# EAGLE design tqfp-80 (EAGLE 6.4)
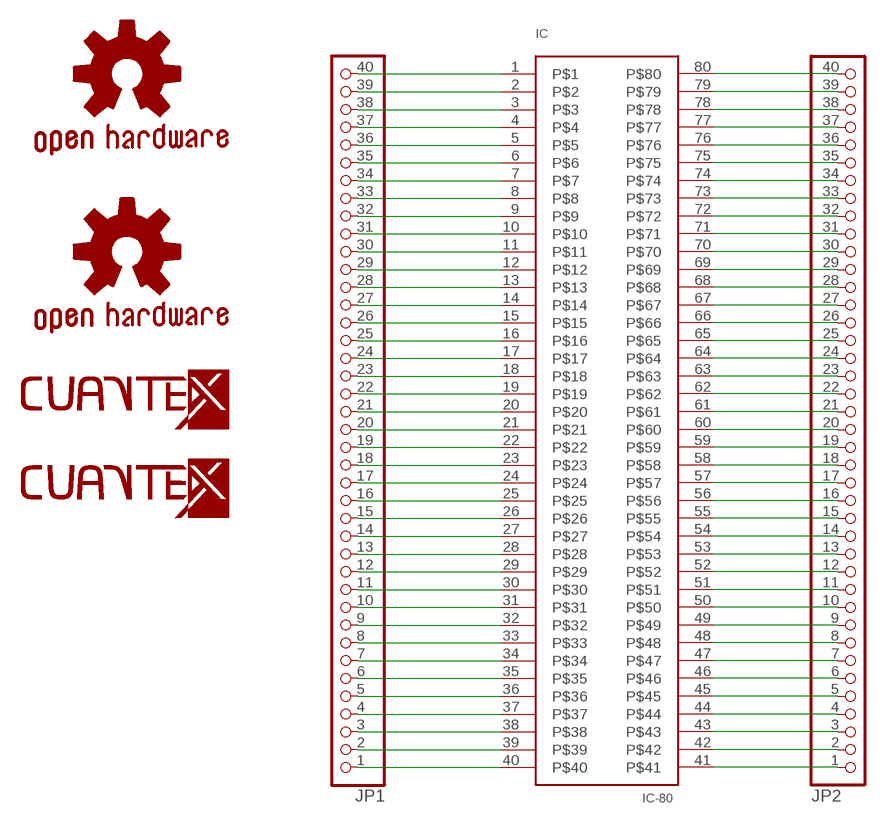
[diagram p0: schematic, sheet 1]

## Parts
GOLD_ORB_SM1  OSHWLOGO_GOLD_ORB_SM  [OSHW2]
GOLD_ORB_SM2  OSHWLOGO_GOLD_ORB_SM  [OSHW2]
IC  IC-80  [TQFP-80]
JP1  PINHD-1X40  [1X40]
JP2  PINHD-1X40  [1X40]
U$2  LOGO-TOP-30MM  [C-1]
U$3  LOGO-TOP-15MM  [C-00]

## Nets
N$1: IC.40 JP1.1
N$2: IC.39 JP1.2
N$3: IC.38 JP1.3
N$4: IC.37 JP1.4
N$5: IC.36 JP1.5
N$6: IC.35 JP1.6
N$7: IC.34 JP1.7
N$8: IC.33 JP1.8
N$9: IC.32 JP1.9
N$10: IC.31 JP1.10
N$11: IC.30 JP1.11
N$12: IC.29 JP1.12
N$13: IC.28 JP1.13
N$14: IC.27 JP1.14
N$15: IC.26 JP1.15
N$16: IC.25 JP1.16
N$17: IC.24 JP1.17
N$18: IC.23 JP1.18
N$19: IC.22 JP1.19
N$20: IC.21 JP1.20
N$21: IC.20 JP1.21
N$22: IC.19 JP1.22
N$23: IC.18 JP1.23
N$24: IC.17 JP1.24
N$25: IC.16 JP1.25
N$26: IC.15 JP1.26
N$27: IC.14 JP1.27
N$28: IC.13 JP1.28
N$29: IC.12 JP1.29
N$30: IC.11 JP1.30
N$31: IC.10 JP1.31
N$32: IC.9 JP1.32
N$33: IC.8 JP1.33
N$34: IC.7 JP1.34
N$35: IC.6 JP1.35
N$36: IC.5 JP1.36
N$37: IC.4 JP1.37
N$38: IC.3 JP1.38
N$39: IC.2 JP1.39
N$40: IC.1 JP1.40
N$41: IC.41 JP2.1
N$42: IC.42 JP2.2
N$43: IC.43 JP2.3
N$44: IC.44 JP2.4
N$45: IC.45 JP2.5
N$46: IC.46 JP2.6
N$47: IC.47 JP2.7
N$48: IC.48 JP2.8
N$49: IC.49 JP2.9
N$50: IC.50 JP2.10
N$51: IC.51 JP2.11
N$52: IC.52 JP2.12
N$53: IC.53 JP2.13
N$54: IC.54 JP2.14
N$55: IC.55 JP2.15
N$56: IC.56 JP2.16
N$57: IC.57 JP2.17
N$58: IC.58 JP2.18
N$59: IC.59 JP2.19
N$60: IC.60 JP2.20
N$61: IC.61 JP2.21
N$62: IC.62 JP2.22
N$63: IC.63 JP2.23
N$64: IC.64 JP2.24
N$65: IC.65 JP2.25
N$66: IC.66 JP2.26
N$67: IC.67 JP2.27
N$68: IC.68 JP2.28
N$69: IC.69 JP2.29
N$70: IC.70 JP2.30
N$71: IC.71 JP2.31
N$72: IC.72 JP2.32
N$73: IC.73 JP2.33
N$74: IC.74 JP2.34
N$75: IC.75 JP2.35
N$76: IC.76 JP2.36
N$77: IC.77 JP2.37
N$78: IC.78 JP2.38
N$79: IC.79 JP2.39
N$80: IC.80 JP2.40

## Library data of the parts
GOLD_ORB_SM1 GOLD_ORB_SM2 = OPENHW:OSHWLOGO: These are Open-Source Hardware logos.
IC = cu01:IC-80
JP1 JP2 = pinhead:PINHD-1X40: PIN HEADER
U$2 = LOGOTIPOS:LOGO-TOP-30MM
U$3 = LOGOTIPOS:LOGO-TOP-15MM

## Board
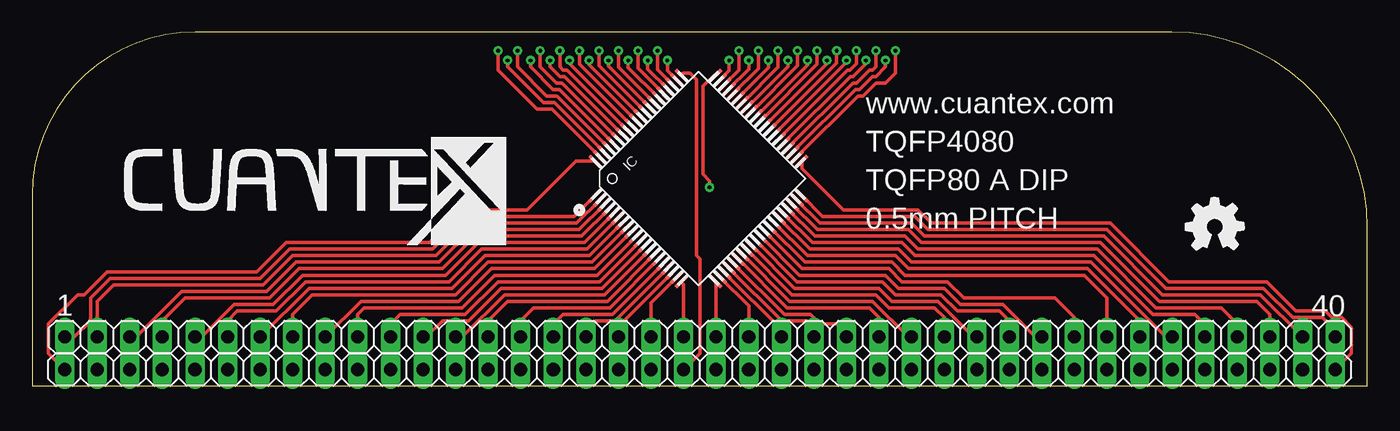
[diagram p1: board, top side]
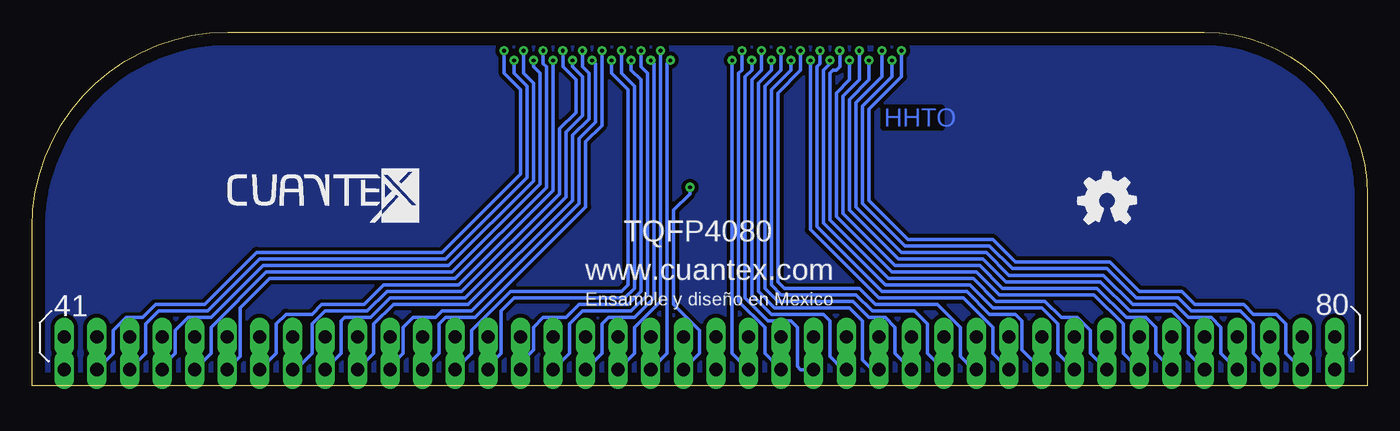
[diagram p2: board, bottom side, seen from below]

Size 104.12 x 27.61 mm. Coordinates in mm from the lower left corner, seen from the top.
Outline: 0,0 104.12,0 104.12,12.36 arc90 88.87,27.61 12.73,27.61 arc90 0,14.88 0,0
Copper layers (1*16): Top 0.035mm / dielectric 1.5mm / Bottom 0.035mm
Design rules "default *": minimum track width 10mil, minimum drill 24mil, track to track 8mil, track to pad 8mil, pad to pad 8mil, via to via 8mil, smd to smd 8mil, copper to edge 40mil, drill to drill 8mil, minimum pad ring 10mil, minimum via ring 8mil, stop-mask expansion 4mil, vias tented up to drill 0mil, thermal gap 10mil

### Footprints (pad centres in the part's own frame; a part is rotated, then mirrored left to right if it is on the bottom)
TQFP-80 = smd 1.2 x 0.27: 1 -5.89,4.6; 2 -5.89,4.1; 3 -5.89,3.6; 4 -5.89,3.1; 5 -5.89,2.6; 6 -5.89,2.1; 7 -5.89,1.6; 8 -5.89,1.1; 9 -5.89,0.6; 10 -5.89,0.1; 11 -5.89,-0.4; 12 -5.89,-0.9; 13 -5.89,-1.4; 14 -5.89,-1.9; 15 -5.89,-2.4; 16 -5.89,-2.9; 17 -5.89,-3.4; 18 -5.89,-3.9; 19 -5.89,-4.4; 20 -5.89,-4.9; 41 7.41,-4.9; 42 7.41,-4.4; 43 7.41,-3.9; 44 7.41,-3.4; 45 7.41,-2.9; 46 7.41,-2.4; 47 7.41,-1.9; 48 7.41,-1.4; 49 7.41,-0.9; 50 7.41,-0.4; 51 7.41,0.1; 52 7.41,0.6; 53 7.41,1.1; 54 7.41,1.6; 55 7.41,2.1; 56 7.41,2.6; 57 7.41,3.1; 58 7.41,3.6; 59 7.41,4.1; 60 7.41,4.6 | smd 0.27 x 1.2: 21 -3.99,-6.8; 22 -3.49,-6.8; 23 -2.99,-6.8; 24 -2.49,-6.8; 25 -1.99,-6.8; 26 -1.49,-6.8; 27 -0.99,-6.8; 28 -0.49,-6.8; 29 0.01,-6.8; 30 0.51,-6.8; 31 1.01,-6.8; 32 1.51,-6.8; 33 2.01,-6.8; 34 2.51,-6.8; 35 3.01,-6.8; 36 3.51,-6.8; 37 4.01,-6.8; 38 4.51,-6.8; 39 5.01,-6.8; 40 5.51,-6.8; 61 5.51,6.5; 62 5.01,6.5; 63 4.51,6.5; 64 4.01,6.5; 65 3.51,6.5; 66 3.01,6.5; 67 2.51,6.5; 68 2.01,6.5; 69 1.51,6.5; 70 1.01,6.5; 71 0.51,6.5; 72 0.01,6.5; 73 -0.49,6.5; 74 -0.99,6.5; 75 -1.49,6.5; 76 -1.99,6.5; 77 -2.49,6.5; 78 -2.99,6.5; 79 -3.49,6.5; 80 -3.99,6.5
1X40 = drill 1.016 long: 1 -49.53,0; 2 -46.99,0; 3 -44.45,0; 4 -41.91,0; 5 -39.37,0; 6 -36.83,0; 7 -34.29,0; 8 -31.75,0; 9 -29.21,0; 10 -26.67,0; 11 -24.13,0; 12 -21.59,0; 13 -19.05,0; 14 -16.51,0; 15 -13.97,0; 16 -11.43,0; 17 -8.89,0; 18 -6.35,0; 19 -3.81,0; 20 -1.27,0; 21 1.27,0; 22 3.81,0; 23 6.35,0; 24 8.89,0; 25 11.43,0; 26 13.97,0; 27 16.51,0; 28 19.05,0; 29 21.59,0; 30 24.13,0; 31 26.67,0; 32 29.21,0; 33 31.75,0; 34 34.29,0; 35 36.83,0; 36 39.37,0; 37 41.91,0; 38 44.45,0; 39 46.99,0; 40 49.53,0

### Placement (x,y rotation side)
GOLD_ORB_SM1  88.39,8.13 0 top
GOLD_ORB_SM2  24.13,10.16 0 bottom
IC  51.31,15.75 45 top
JP1  52.07,3.81 180 top
JP2  52.07,1.27 180 top
U$2  7.11,10.92 0 top
U$3  88.9,12.7 0 bottom

### Tracks (layer width: path | path; a pad name or v marks a point on that pad's centre or on a via)
N$1
  Top 0.254: IC.40 61.64,13.21 68.83,13.21 69.85,12.19 83.82,12.19 88.39,7.62 96.01,7.62 98.3,5.33 100.58,5.33 101.6,4.32 JP1.1
N$2
  Top 0.254: IC.39 61.44,12.7 68.58,12.7 69.6,11.68 83.57,11.68 88.14,7.11 95.76,7.11 JP1.2
N$3
  Top 0.254: IC.38 61.24,12.19 68.33,12.19 69.34,11.18 83.31,11.18 87.88,6.6 95.5,6.6 96.52,5.59 JP1.3
N$4
  Top 0.254: IC.37 61.04,11.68 68.07,11.68 69.09,10.67 83.06,10.67 87.63,6.1 92.71,6.1 93.98,4.83 JP1.4
N$5
  Top 0.254: IC.36 60.84,11.18 67.82,11.18 68.83,10.16 82.8,10.16 87.38,5.59 90.68,5.59 91.44,4.83 JP1.5
N$6
  Top 0.254: IC.35 60.65,10.67 67.56,10.67 68.58,9.65 82.55,9.65 88.39,3.81 JP1.6
N$7
  Top 0.254: IC.34 60.45,10.16 67.31,10.16 68.33,9.14 82.3,9.14 86.36,5.08 JP1.7
N$8
  Top 0.254: IC.33 60.25,9.65 67.06,9.65 68.07,8.64 82.04,8.64 83.82,6.86 JP1.8
N$9
  Top 0.254: IC.32 60.05,9.14 66.8,9.14 67.82,8.13 71.37,8.13 72.64,6.86 79.76,6.86 81.28,5.33 JP1.9
N$10
  Top 0.254: IC.31 59.85,8.64 66.55,8.64 67.56,7.62 71.12,7.62 72.39,6.35 75.69,6.35 78.23,3.81 JP1.10
N$11
  Top 0.254: IC.30 59.65,8.13 66.29,8.13 67.31,7.11 70.87,7.11 72.14,5.84 75.44,5.84 76.2,5.08 JP1.11
N$12
  Top 0.254: IC.29 59.45,7.62 66.04,7.62 67.06,6.6 70.61,6.6 73.41,3.81 JP1.12
N$13
  Top 0.254: IC.28 59.25,7.11 65.79,7.11 66.8,6.1 70.36,6.1 71.12,5.33 JP1.13
N$14
  Top 0.254: IC.27 59.05,6.6 65.53,6.6 68.33,3.81 JP1.14
N$15
  Top 0.254: IC.26 58.85,6.1 65.28,6.1 66.04,5.33 JP1.15
N$16
  Top 0.254: IC.25 58.65,5.59 60.71,5.59 61.47,4.83 62.99,4.83 63.5,4.32 JP1.16
N$17
  Top 0.254: IC.24 58.45,5.08 60.45,5.08 60.96,4.57 JP1.17
N$18
  Top 0.254: IC.23 58.42,4.41 JP1.18
N$19
  Top 0.254: IC.22 55.88,6.24 JP1.19
N$20
  Top 0.254: IC.21 53.34,8.07 JP1.20
N$21
  Top 0.254: IC.20 50.8,7.93 JP1.21
N$22
  Top 0.254: IC.19 48.26,6.48 JP1.22
N$23
  Top 0.254: IC.18 45.72,4.64 JP1.23
N$24
  Top 0.254: IC.17 45.45,5.08 43.94,5.08 43.18,4.32 JP1.24
N$25
  Top 0.254: IC.16 45.25,5.59 41.4,5.59 40.64,4.83 JP1.25
N$26
  Top 0.254: IC.15 45.05,6.1 39.12,6.1 38.1,5.08 JP1.26
N$27
  Top 0.254: IC.14 44.85,6.6 37.08,6.6 35.56,5.08 JP1.27
N$28
  Top 0.254: IC.13 44.65,7.11 36.83,7.11 33.53,3.81 JP1.28
N$29
  Top 0.254: IC.12 44.45,7.62 36.58,7.62 34.04,5.08 32,5.08 30.73,3.81 JP1.29
N$30
  Top 0.254: IC.11 44.25,8.13 36.32,8.13 33.78,5.59 28.7,5.59 27.94,4.83 JP1.30
N$31
  Top 0.254: IC.10 44.05,8.64 36.07,8.64 33.53,6.1 25.91,6.1 25.4,5.59 JP1.31
N$32
  Top 0.254: IC.9 43.85,9.14 35.81,9.14 33.27,6.6 25.65,6.6 JP1.32
N$33
  Top 0.254: IC.8 43.66,9.65 35.56,9.65 33.02,7.11 21.84,7.11 20.32,5.59 JP1.33
N$34
  Top 0.254: IC.7 43.46,10.16 35.31,10.16 32.77,7.62 21.59,7.62 JP1.34
N$35
  Top 0.254: IC.6 43.26,10.67 35.05,10.67 32.51,8.13 21.34,8.13 19.05,5.84 16,5.84 15.24,5.08 JP1.35
N$36
  Top 0.254: IC.5 43.06,11.18 34.8,11.18 32.26,8.64 21.08,8.64 18.8,6.35 15.75,6.35 13.21,3.81 JP1.36
N$37
  Top 0.254: IC.4 42.86,11.68 34.54,11.68 32,9.14 20.83,9.14 18.54,6.86 11.94,6.86 10.16,5.08 JP1.37
N$38
  Top 0.254: IC.3 42.66,12.19 34.29,12.19 31.75,9.65 20.57,9.65 18.29,7.37 11.68,7.37 8.13,3.81 JP1.38
N$39
  Top 0.254: IC.2 42.46,12.7 34.04,12.7 31.5,10.16 20.32,10.16 18.03,7.87 6.35,7.87 5.08,6.6 JP1.39
N$40
  Top 0.254: IC.1 42.26,13.21 33.78,13.21 31.24,10.67 20.07,10.67 17.78,8.38 6.1,8.38 4.57,6.86 4.57,5.08 3.3,3.81 JP1.40
N$41
  Top 0.254: JP2.1 102.87,2.54 102.87,4.57 102.11,5.33 101.35,5.33 100.84,5.84 98.55,5.84 96.27,8.13 88.65,8.13 84.07,12.7 70.1,12.7 69.09,13.72 63.25,13.72 60.01,16.95 IC.41
N$42  (via drill 0.3)
  Top 0.254: IC.42 64.39,22.61 64.77,22.61 65.79,23.62 66.55,23.62 67.31,24.38 v67.31,26.16
  Bottom 0.254: JP2.2 97.79,2.54 97.79,4.32 96.77,5.33 95.5,5.33 94.49,6.35 90.68,6.35 86.61,10.41 72.14,10.41 66.04,16.51 66.04,23.11 67.31,24.38 v67.31,26.16
N$43  (via drill 0.3)
  Top 0.254: IC.43 64.19,23.11 64.52,23.11 65.53,24.13 65.79,24.13 66.55,24.89 v66.55,25.4
  Bottom 0.254: JP2.3 95.25,2.54 95.25,4.83 94.23,5.84 90.42,5.84 86.36,9.91 71.88,9.91 65.53,16.26 65.53,23.37 66.55,24.38 v66.55,25.4
N$44  (via drill 0.3)
  Top 0.254: IC.44 63.99,23.62 64.26,23.62 65.28,24.64 65.53,24.64 65.79,24.89 v65.79,26.16
  Bottom 0.254: JP2.4 93.98,1.52 92.96,2.54 92.96,4.32 91.95,5.33 90.17,5.33 86.11,9.4 71.63,9.4 65.02,16 65.02,23.62 65.79,24.38 v65.79,26.16
N$45  (via drill 0.3)
  Top 0.254: IC.45 63.79,24.13 64.01,24.13 65.02,25.15 v65.02,25.4
  Bottom 0.254: JP2.5 90.17,2.54 90.17,4.57 85.85,8.89 71.37,8.89 64.52,15.75 64.52,24.38 65.02,24.89 v65.02,25.4
N$46  (via drill 0.3)
  Top 0.254: IC.46 63.59,24.64 63.75,24.64 64.26,25.15 v64.26,26.16
  Bottom 0.254: JP2.6 87.88,2.29 87.88,6.1 85.6,8.38 71.12,8.38 64.01,15.49 64.01,24.89 64.26,25.15 v64.26,26.16
N$47  (via drill 0.3)
  Top 0.254: IC.47 63.5,25.25 v63.5,25.4
  Bottom 0.254: JP2.7 85.09,2.54 85.09,4.83 84.33,5.59 82.3,5.59 81.53,6.35 78.23,6.35 76.71,7.87 70.87,7.87 63.5,15.24 v63.5,25.4
N$48  (via drill 0.3)
  Top 0.254: IC.48 62.74,25.2 v62.74,26.16
  Bottom 0.254: JP2.8 83.57,1.27 82.3,2.54 82.3,4.83 81.28,5.84 77.98,5.84 76.45,7.37 70.61,7.37 62.99,14.99 62.99,20.07 61.72,21.34 61.72,23.88 62.74,24.89 v62.74,26.16
N$49  (via drill 0.3)
  Top 0.254: IC.49 61.98,25.14 v61.98,25.4
  Bottom 0.254: JP2.9 80.01,2.54 80.01,5.08 79.76,5.33 77.72,5.33 76.2,6.86 70.36,6.86 62.48,14.73 62.48,19.81 61.21,21.08 61.21,24.13 61.98,24.89 v61.98,25.4
N$50  (via drill 0.3)
  Top 0.254: IC.50 61.21,25.09 v61.21,26.16
  Bottom 0.254: JP2.10 77.47,2.54 77.47,4.83 75.95,6.35 70.1,6.35 61.98,14.48 61.98,19.56 60.71,20.83 60.71,24.38 61.21,24.89 v61.21,26.16
N$51  (via drill 0.3)
  Top 0.254: IC.51 60.45,25.03 v60.45,25.4
  Bottom 0.254: JP2.11 76.2,1.52 75.18,2.54 75.18,4.57 74.42,5.33 72.64,5.33 72.14,5.84 69.85,5.84 61.47,14.22 61.47,19.3 60.2,20.57 60.2,25.15 v60.45,25.4
N$52  (via drill 0.3)
  Top 0.254: IC.52 59.69,24.98 v59.69,26.16
  Bottom 0.254: JP2.12 72.39,2.54 72.39,4.83 71.88,5.33 69.6,5.33 60.96,13.97 60.96,19.05 59.69,20.32 v59.69,26.16
N$53  (via drill 0.3)
  Top 0.254: IC.53 58.93,24.92 v58.93,25.4
  Bottom 0.254: JP2.13 69.85,2.54 69.85,4.32 66.8,7.37 58.17,7.37 57.66,7.87 57.66,23.11 58.93,24.38 v58.93,25.4
N$54  (via drill 0.3)
  Top 0.254: IC.54 58.17,24.87 v58.17,26.16
  Bottom 0.254: JP2.14 68.58,1.52 67.56,2.54 67.56,5.84 66.55,6.86 57.91,6.86 57.15,7.62 57.15,23.37 58.17,24.38 v58.17,26.16
N$55  (via drill 0.3)
  Top 0.254: IC.55 57.4,24.81 v57.4,25.4
  Bottom 0.254: JP2.15 66.04,1.78 65.02,2.79 65.02,4.57 64.26,5.33 62.48,5.33 61.47,6.35 57.66,6.35 56.64,7.37 56.64,23.88 57.4,24.64 v57.4,25.4
N$56  (via drill 0.3)
  Top 0.254: IC.56 56.64,24.76 v56.64,26.16
  Bottom 0.254: JP2.16 62.23,2.54 62.23,4.83 61.21,5.84 57.4,5.84 56.13,7.11 56.13,24.38 56.64,24.89 v56.64,26.16
N$57  (via drill 0.3)
  Top 0.254: IC.57 55.88,24.7 v55.88,25.4
  Bottom 0.254: JP2.17 59.69,2.54 59.69,4.83 59.18,5.33 57.15,5.33 55.63,6.86 55.63,25.15 v55.88,25.4
N$58  (via drill 0.3)
  Top 0.254: IC.58 55.12,24.65 v55.12,26.16
  Bottom 0.254: JP2.18 57.15,2.54 57.15,4.57 55.12,6.6 v55.12,26.16
N$59  (via drill 0.3)
  Top 0.254: IC.59 54.36,24.59 v54.36,25.4
  Bottom 0.254: JP2.19 54.61,2.54 54.61,25.15 v54.36,25.4
N$60  (via drill 0.3)
  Top 0.254: IC.60 53.2,24.24 52.32,23.37 52.32,16.51 52.83,16 v52.83,15.49
  Bottom 0.254: JP2.20 52.07,2.54 52.07,4.32 54.1,6.35 54.1,13.72 52.83,14.99 v52.83,15.49
N$61
  Top 0.254: IC.61 50.75,24.38 51.31,24.38 51.82,23.88 51.82,10.16 52.07,9.91 52.07,2.54 JP2.21
N$62  (via drill 0.3)
  Top 0.254: IC.62 49.53,24.61 v49.53,25.4
  Bottom 0.254: v49.53,25.4 49.53,2.54 JP2.22
N$63  (via drill 0.3)
  Top 0.254: IC.63 48.77,24.67 v48.77,26.16
  Bottom 0.254: v48.77,26.16 48.77,24.64 49.02,24.38 49.02,6.6 46.99,4.57 46.99,2.54 JP2.23
N$64  (via drill 0.3)
  Top 0.254: IC.64 48.01,24.72 v48.01,25.4
  Bottom 0.254: v48.01,25.4 48.01,24.64 48.51,24.13 48.51,6.86 46.74,5.08 44.96,5.08 44.45,4.57 44.45,1.52 44.2,1.27 JP2.24
N$65  (via drill 0.3)
  Top 0.254: IC.65 47.24,24.78 v47.24,26.16
  Bottom 0.254: v47.24,26.16 47.24,24.64 48.01,23.88 48.01,7.11 46.48,5.59 42.42,5.59 41.91,5.08 41.91,2.29 40.89,1.27 JP2.25
N$66  (via drill 0.3)
  Top 0.254: IC.66 46.48,24.83 v46.48,25.4
  Bottom 0.254: v46.48,25.4 46.48,24.64 47.5,23.62 47.5,7.37 46.23,6.1 40.39,6.1 39.37,5.08 39.37,2.03 38.61,1.27 JP2.26
N$67  (via drill 0.3)
  Top 0.254: IC.67 45.72,24.89 v45.72,26.16
  Bottom 0.254: v45.72,26.16 45.72,24.64 46.99,23.37 46.99,7.62 45.97,6.6 40.13,6.6 38.86,5.33 37.59,5.33 36.83,4.57 36.83,2.54 JP2.27
N$68  (via drill 0.3)
  Top 0.254: IC.68 44.96,24.94 v44.96,25.4
  Bottom 0.254: v44.96,25.4 44.96,24.64 46.48,23.11 46.48,7.87 45.72,7.11 39.88,7.11 38.61,5.84 35.31,5.84 34.29,4.83 34.29,2.54 JP2.28
N$69  (via drill 0.3)
  Top 0.254: IC.69 44.2,25 v44.2,26.16
  Bottom 0.254: v44.2,26.16 44.2,24.64 45.97,22.86 45.97,8.13 45.47,7.62 39.62,7.62 38.35,6.35 33.53,6.35 31.75,4.57 31.75,2.29 30.73,1.27 JP2.29
N$70  (via drill 0.3)
  Top 0.254: IC.70 43.43,25.05 v43.43,25.4
  Bottom 0.254: v43.43,25.4 43.43,12.19 38.1,6.86 31.5,6.86 29.21,4.57 29.21,2.54 JP2.30
N$71  (via drill 0.3)
  Top 0.254: v42.67,26.16 42.67,25.11 IC.71
  Bottom 0.254: JP2.31 26.92,2.79 26.92,5.08 27.43,5.59 29.46,5.59 31.24,7.37 37.85,7.37 42.93,12.45 42.93,24.89 42.67,25.15 v42.67,26.16
N$72  (via drill 0.3)
  Top 0.254: v41.91,25.4 41.91,25.16 IC.72
  Bottom 0.254: JP2.32 24.13,2.54 24.13,4.83 25.4,6.1 29.21,6.1 30.99,7.87 37.59,7.87 42.42,12.7 42.42,24.64 41.91,25.15 v41.91,25.4
N$73  (via drill 0.3)
  Top 0.254: IC.73 41.73,24.64 41.4,24.64 41.15,24.89 v41.15,26.16
  Bottom 0.254: JP2.33 21.59,2.54 21.59,4.32 22.61,5.33 23.88,5.33 25.15,6.6 28.96,6.6 30.73,8.38 37.34,8.38 41.91,12.95 41.91,24.38 41.66,24.64 41.4,24.64 41.15,24.89 v41.15,26.16
N$74  (via drill 0.3)
  Top 0.254: v40.39,25.4 40.39,24.89 41.15,24.13 41.53,24.13 IC.74
  Bottom 0.254: JP2.34 19.05,2.54 19.05,4.83 21.34,7.11 28.7,7.11 30.48,8.89 37.08,8.89 41.4,13.21 41.4,22.86 40.39,23.88 v40.39,25.4
N$75  (via drill 0.3)
  Top 0.254: IC.75 41.33,23.62 40.89,23.62 39.62,24.89 v39.62,26.16
  Bottom 0.254: JP2.35 16.51,2.54 16.51,4.57 17.27,5.33 18.8,5.33 21.08,7.62 28.45,7.62 30.23,9.4 36.83,9.4 40.89,13.46 40.89,22.61 39.62,23.88 v39.62,26.16
N$76  (via drill 0.3)
  Top 0.254: IC.76 41.13,23.11 40.64,23.11 38.86,24.89 v38.86,25.4
  Bottom 0.254: JP2.36 13.97,2.54 13.97,4.57 15.24,5.84 18.54,5.84 20.83,8.13 28.19,8.13 29.97,9.91 36.58,9.91 40.39,13.72 40.39,22.35 38.86,23.88 v38.86,25.4
N$77  (via drill 0.3)
  Top 0.254: IC.77 40.93,22.61 40.13,22.61 37.85,24.89 v37.85,26.16
  Bottom 0.254: JP2.37 11.43,2.54 11.43,4.57 12.19,5.33 13.97,5.33 14.99,6.35 18.29,6.35 20.57,8.64 27.94,8.64 29.72,10.41 36.32,10.41 39.88,13.97 39.88,22.1 37.85,24.13 v37.85,26.16
N$78  (via drill 0.3)
  Top 0.254: IC.78 40.73,22.1 39.88,22.1 37.08,24.89 v37.08,25.4
  Bottom 0.254: JP2.38 8.89,2.54 8.89,4.83 9.91,5.84 13.72,5.84 14.73,6.86 18.03,6.86 20.32,9.14 27.69,9.14 29.46,10.92 36.07,10.92 39.37,14.22 39.37,21.84 37.08,24.13 v37.08,25.4
N$79  (via drill 0.3)
  Top 0.254: IC.79 40.53,21.59 39.37,21.59 36.32,24.64 v36.32,26.16
  Bottom 0.254: JP2.39 6.35,2.54 6.35,4.83 7.11,5.59 8.89,5.59 9.65,6.35 13.46,6.35 14.48,7.37 17.78,7.37 20.07,9.65 27.43,9.65 29.21,11.43 35.81,11.43 38.86,14.48 38.86,21.59 36.32,24.13 v36.32,26.16
N$80
  Top 0.254: JP2.40 1.27,2.54 1.27,4.83 3.56,7.11 4.06,7.11 5.84,8.89 17.53,8.89 19.81,11.18 30.99,11.18 33.53,13.72 38.61,13.72 42.41,17.52 IC.80
N$81
  pour Bottom (isolate 0.305): 0,-0.73 104,-0.73 104,10.27 arc90 91,28.27 12,28.27 arc90 0,13.27

### Text on the board
Bottom: HHTO
tPlace: www.cuantex.com | TQFP4080 | TQFP80 A DIP | 0.5mm PITCH | 1 | 40
bPlace: TQFP4080 | www.cuantex.com | Ensamble y diseño en Mexico | 80 | 41